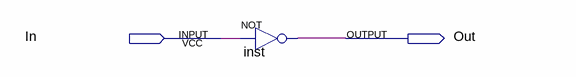
[diagram p0: schematic sheet]
// Quartus schematic test2.bdf as structural Verilog: 1 symbols, 2 pins
module test2 (
  input  In,
  output Out
);

  not inst (Out, In);
endmodule
